# EAGLE design pcb (EAGLE 9.6.2)
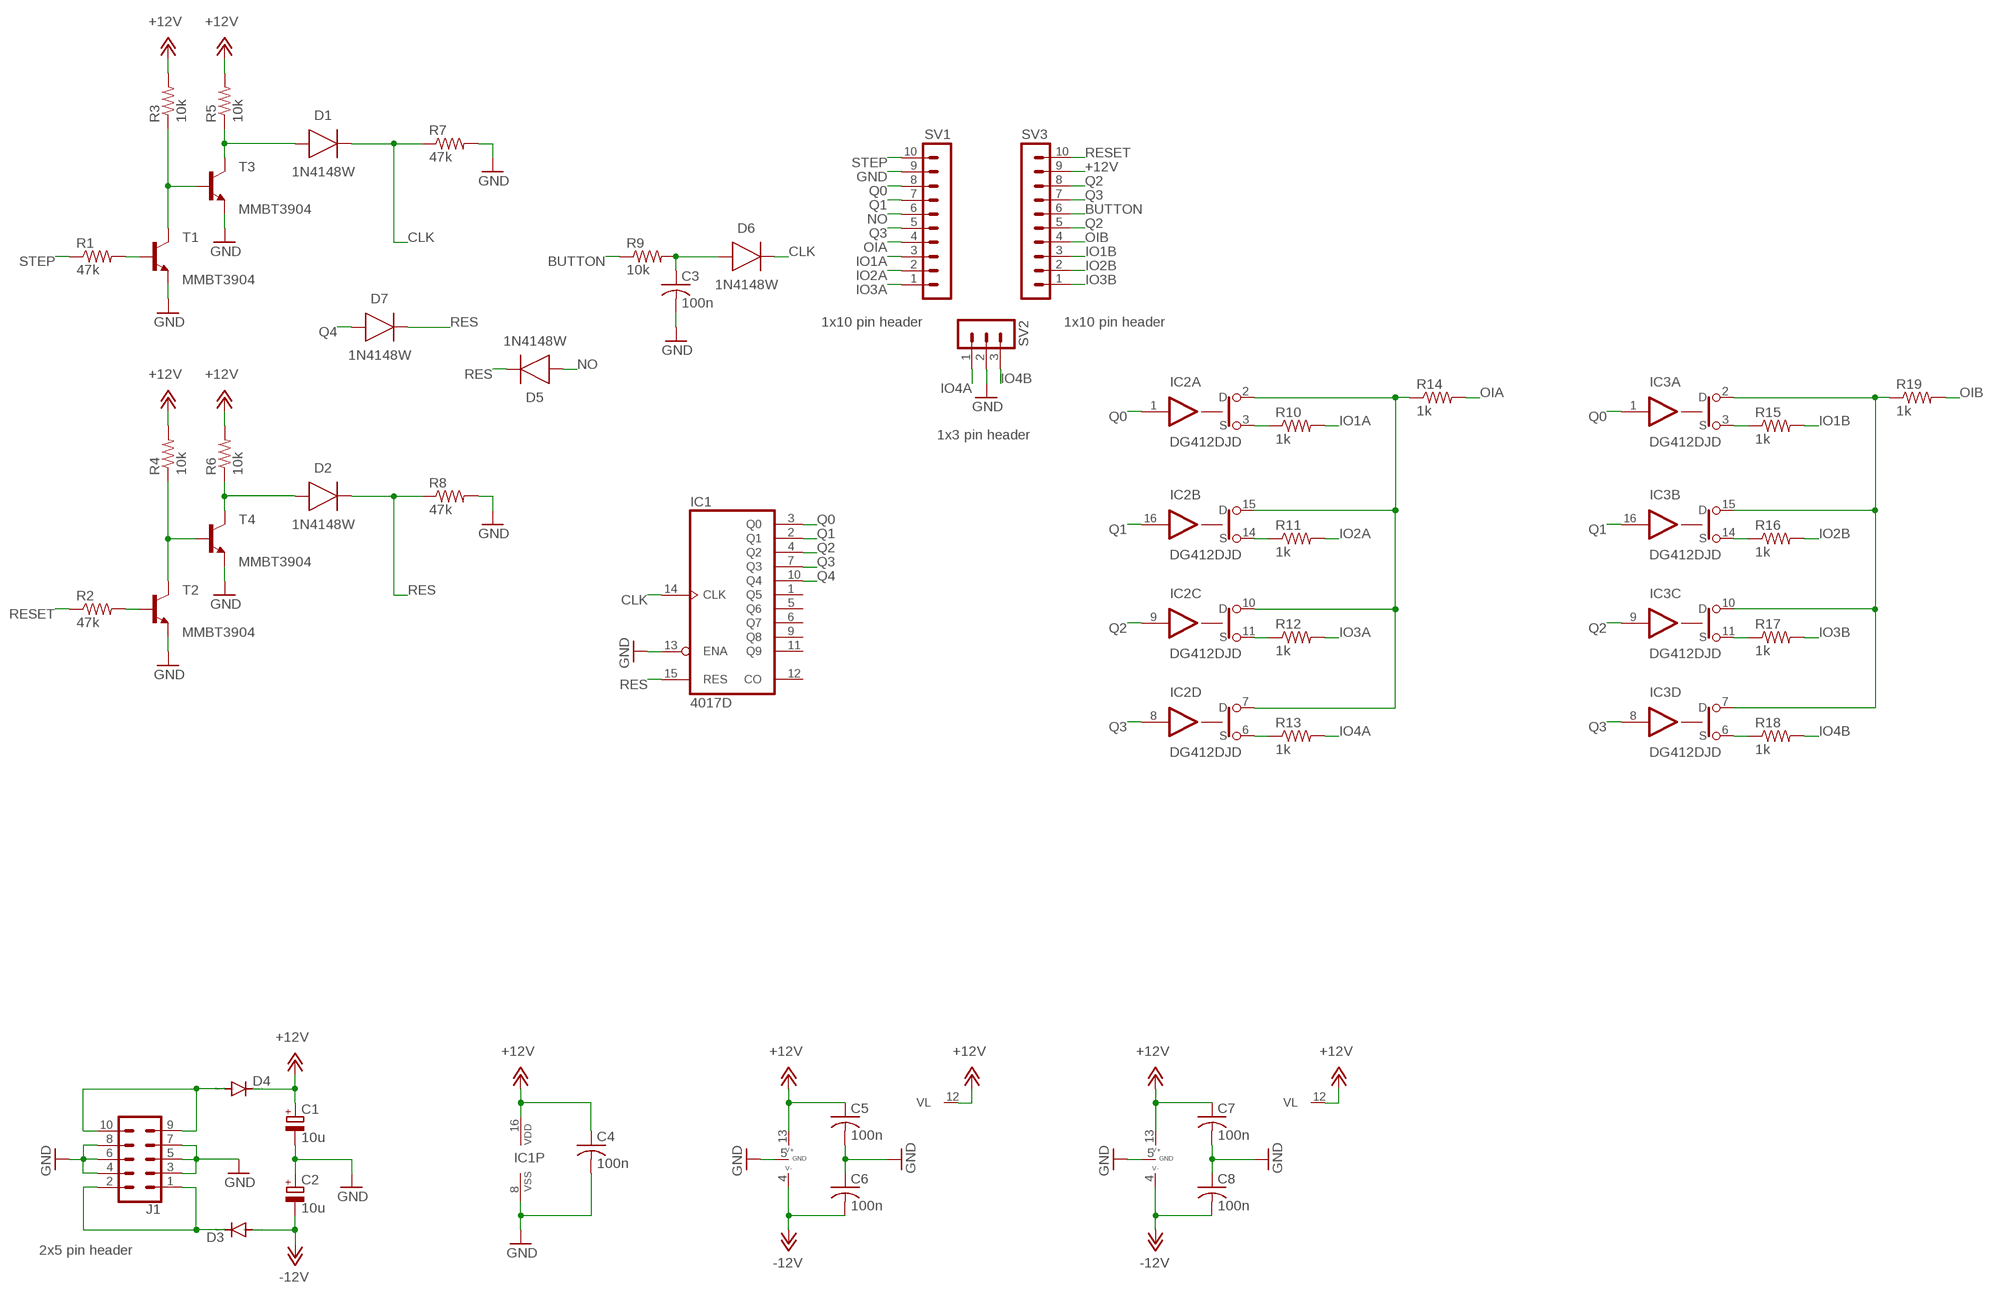
[diagram p0: schematic, sheet 1]

## Parts
C1  10u  CPOL-EU153CLV-0605  [153CLV-0605]
C2  10u  CPOL-EU153CLV-0605  [153CLV-0605]
C3  100n  C-USC0603  [C0603]
C4  100n  C-USC0603  [C0603]
C5  100n  C-USC0603  [C0603]
C6  100n  C-USC0603  [C0603]
C7  100n  C-USC0603  [C0603]
C8  100n  C-USC0603  [C0603]
D1  1N4148W  DIODE_1N4148W-7-F_SOD123G  [SOD3715X135]
D2  1N4148W  DIODE_1N4148W-7-F_SOD123G  [SOD3715X135]
D3  DIODE-SOD123  [SOD123]
D4  DIODE-SOD123  [SOD123]
D5  1N4148W  DIODE_1N4148W-7-F_SOD123G  [SOD3715X135]
D6  1N4148W  DIODE_1N4148W-7-F_SOD123G  [SOD3715X135]
D7  1N4148W  DIODE_1N4148W-7-F_SOD123G  [SOD3715X135]
IC1  4017D  [SO16]
IC2  DG412DJD  [SO16]
IC3  DG412DJD  [SO16]
J1  2x5 pin header  CONN_05X2SHD  [2X5-SHROUDED]
R1  47k  R-US_R0603  [R0603]
R2  47k  R-US_R0603  [R0603]
R3  10k  R-US_R0603  [R0603]
R4  10k  R-US_R0603  [R0603]
R5  10k  R-US_R0603  [R0603]
R6  10k  R-US_R0603  [R0603]
R7  47k  R-US_R0603  [R0603]
R8  47k  R-US_R0603  [R0603]
R9  10k  R-US_R0603  [R0603]
R10  1k  R-US_R0603  [R0603]
R11  1k  R-US_R0603  [R0603]
R12  1k  R-US_R0603  [R0603]
R13  1k  R-US_R0603  [R0603]
R14  1k  R-US_R0603  [R0603]
R15  1k  R-US_R0603  [R0603]
R16  1k  R-US_R0603  [R0603]
R17  1k  R-US_R0603  [R0603]
R18  1k  R-US_R0603  [R0603]
R19  1k  R-US_R0603  [R0603]
SV1  1x10 pin header  MA10-1  [MA10-1]
SV2  1x3 pin header  MA03-1  [MA03-1]
SV3  1x10 pin header  MA10-1  [MA10-1]
T1  MMBT3904  MMBT3904LT1-NPN-SOT23-BEC  [SOT23-BEC]
T2  MMBT3904  MMBT3904LT1-NPN-SOT23-BEC  [SOT23-BEC]
T3  MMBT3904  MMBT3904LT1-NPN-SOT23-BEC  [SOT23-BEC]
T4  MMBT3904  MMBT3904LT1-NPN-SOT23-BEC  [SOT23-BEC]

## Nets
+12V [SupplyLines]: C1.+ C4.1 C5.1 C7.1 D4.C IC1.16(VDD) IC2.12(VL:VL) IC2.13(P:V+) IC3.12(VL:VL) IC3.13(P:V+) R3.2 R4.2 R5.2 R6.2 SV3.9
-12V [SupplyLines]: C2.- C6.2 C8.2 D3.A IC2.4(P:V-) IC3.4(P:V-)
BUTTON: R9.1 SV3.6
CLK: D1.1(C) D6.1(C) IC1.14(CLK) R7.1
GND [SupplyLines]: C1.- C2.+ C3.2 C4.2 C5.2 C6.1 C7.2 C8.1 IC1.8(VSS) IC1.13(ENA) IC2.5(P:GND) IC3.5(P:GND) J1.3 J1.4 J1.5 J1.6 J1.7 J1.8 R7.2 R8.2 SV1.9 SV2.2 T1.E T2.E T3.E T4.E
IO1A: R10.2 SV1.3
IO1B: R15.2 SV3.3
IO2A: R11.2 SV1.2
IO2B: R16.2 SV3.2
IO3A: R12.2 SV1.1
IO3B: R17.2 SV3.1
IO4A: R13.2 SV2.1
IO4B: R18.2 SV2.3
N$1 [SupplyLines]: D4.A J1.9 J1.10
N$2 [SupplyLines]: D3.C J1.1 J1.2
N$3: IC2.2(A:D) IC2.7(D:D) IC2.10(C:D) IC2.15(B:D) R14.1
N$4: IC2.3(A:S) R10.1
N$5: IC3.2(A:D) IC3.7(D:D) IC3.10(C:D) IC3.15(B:D) R19.1
N$6: IC2.14(B:S) R11.1
N$7: IC2.11(C:S) R12.1
N$8: IC2.6(D:S) R13.1
N$9: IC3.3(A:S) R15.1
N$10: IC3.14(B:S) R16.1
N$11: IC3.11(C:S) R17.1
N$12: IC3.6(D:S) R18.1
N$13: C3.1 D6.2(A) R9.2
N$14: R1.2 T1.B
N$15: R3.1 T1.C T3.B
N$16: D1.2(A) R5.1 T3.C
N$19: R2.2 T2.B
N$20: R4.1 T2.C T4.B
N$21: D2.2(A) R6.1 T4.C
NO: D5.2(A) SV1.6
OIA: R14.2 SV1.4
OIB: R19.2 SV3.4
Q0: IC1.3(Q0) IC2.1(A:IN) IC3.1(A:IN) SV1.8
Q1: IC1.2(Q1) IC2.16(B:IN) IC3.16(B:IN) SV1.7
Q2: IC1.4(Q2) IC2.9(C:IN) IC3.9(C:IN) SV3.5 SV3.8
Q3: IC1.7(Q3) IC2.8(D:IN) IC3.8(D:IN) SV1.5 SV3.7
Q4: D7.2(A) IC1.10(Q4)
RES: D2.1(C) D5.1(C) D7.1(C) IC1.15(RES) R8.1
RESET: R2.1 SV3.10
STEP: R1.1 SV1.10
Unconnected: IC1.1(Q5) IC1.5(Q6) IC1.6(Q7) IC1.9(Q8) IC1.11(Q9) IC1.12(CO)

## Library data of the parts
C1 C2 = rcl:CPOL-EU: POLARIZED CAPACITOR, European symbol; SPICEPREFIX: C
C3-C8 = rcl:C-US: CAPACITOR, American symbol; SPICEPREFIX: C
D1 D2 D5-D7 = Diode:DIODE_: Diode Rectifier - Popular parts; CATEGORY: Diode; DESCRIPTION: DIODE GEN PURP 100V 300MA SOD123; MANUFACTURER: Diodes Incorporated; SUB-CATEGORY: Rectifier
D3 D4 = diode:DIODE-: DIODE
IC1 = 40xx:4017: COUNTER/DIVIDER
IC2 IC3 = linear:DG412DJ: CMOS SWITCH
J1 = SparkFun-Connectors:CONN_05X2: Multi connection point. Often used as Generic Header-pin footprint for 0.1 inch spaced/style header connections For AVR SPI programming port, see special device with nice symbol: "AVR_SPI_PROG_5x2.dev" You can populate with any combo of single row headers, but if you'd like an exact match, check these: 2x5 AVR ICSP Male Header <https://www.sparkfun.com/products/778> (PRT-00778) 2x5 Pin Shrouded Header <https://www.sparkfun.com/products/8506> (PRT-08506) On any of the 0.1 inch spaced packages, you can populate with these: Break Away Headers - Straight <https://www.sparkfun.com/products/116> (PRT-00116) Break Away Male Headers - Right Angle <https://www.sparkfun.com/products/553> (PRT-00553) Female Headers <https://www.sparkfun.com/products/115> (PRT-00115) Break Away Headers - Machine Pin <https://www.sparkfun.com/products/117> (PRT-00117) Break Away Female Headers - Swiss Machine Pin <https://www.sparkfun.com/products/743> (PRT-00743) Special note: the shrouded connector mates well with our 5x2 ribbon cables: 2x5 Pin IDC Ribbon Cable <https://www.sparkfun.com/products/8535> (PRT-08535); PROD_ID: CONN-08671; SF_ID: PRT-08506
R1-R19 = rcl:R-US_: RESISTOR, American symbol; SPICEPREFIX: R
SV1 SV3 = con-lstb:MA10-1: PIN HEADER; OC_FARNELL: unknown; OC_NEWARK: unknown
SV2 = con-lstb:MA03-1: PIN HEADER; OC_FARNELL: unknown; OC_NEWARK: unknown
T1-T4 = transistor:*-NPN-: NPN Transistror BF959 corrected 2008.03.06

## Net classes
0 default: width 0.254 mm, drill 0.203 mm, clearance 0.203 mm
1 SupplyLines: width 0.406 mm, drill 0.203 mm, clearance 0.203 mm

## Board
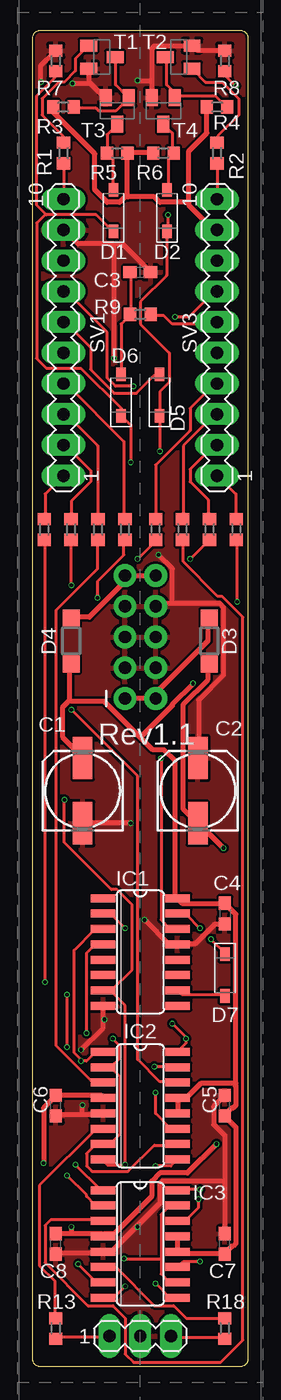
[diagram p1: board, top side]
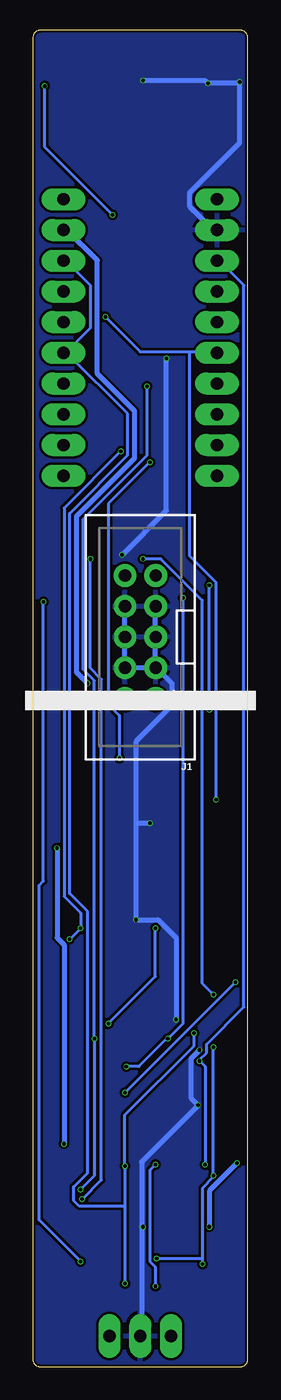
[diagram p2: board, bottom side, seen from below]

Size 17.78 x 110.49 mm. Coordinates in mm from the lower left corner, seen from the top.
Copper layers (1*16): Top 0.035mm / dielectric 1.6mm / Bottom 0.035mm
Design rules "jlcpcb-2layers *": minimum track width 5mil, minimum drill 0.3mm, track to track 5mil, track to pad 5mil, pad to pad 5mil, via to via 10mil, smd to smd 5mil, copper to edge 0.2mm, drill to drill 6mil, minimum pad ring 10mil, minimum via ring 3mil, stop-mask expansion 4mil, vias tented up to drill 0mil, thermal gap 10mil

### Footprints (pad centres in the part's own frame; a part is rotated, then mirrored left to right if it is on the bottom)
153CLV-0605 = smd 3.5 x 1.6: + 2.7,0; - -2.7,0
C0603 = smd 1.1 x 1: 1 -0.85,0; 2 0.85,0
SOD3715X135 = smd 1.127 x 0.784: 1 -1.722,0; 2 1.722,0
SOD123 = smd 1.4 x 1.4: A 1.9,0; C -1.9,0
SO16 = smd 0.66 x 2.032: 1 -4.445,-3.073; 2 -3.175,-3.073; 3 -1.905,-3.073; 4 -0.635,-3.073; 5 0.635,-3.073; 6 1.905,-3.073; 7 3.175,-3.073; 8 4.445,-3.073; 9 4.445,3.073; 10 3.175,3.073; 11 1.905,3.073; 12 0.635,3.073; 13 -0.635,3.073; 14 -1.905,3.073; 15 -3.175,3.073; 16 -4.445,3.073
2X5-SHROUDED = drill 1.016 pad 1.88: 1 -1.27,5.08; 2 1.27,5.08; 3 -1.27,2.54; 4 1.27,2.54; 5 -1.27,0; 6 1.27,0; 7 -1.27,-2.54; 8 1.27,-2.54; 9 -1.27,-5.08; 10 1.27,-5.08
R0603 = smd 1 x 1.1: 1 -0.85,0; 2 0.85,0
MA10-1 = drill 1.016 long: 1 -11.43,0; 2 -8.89,0; 3 -6.35,0; 4 -3.81,0; 5 -1.27,0; 6 1.27,0; 7 3.81,0; 8 6.35,0; 9 8.89,0; 10 11.43,0
MA03-1 = drill 1.016 long: 1 -2.54,0; 2 0,0; 3 2.54,0
SOT23-BEC = smd 1 x 1.4: B -0.95,-1.1; C 0,1.1; E 0.95,-1.1

### Placement (x,y rotation side)
C1  4.13,47.62 90 top
C2  13.65,47.62 90 top
C3  8.89,90.49 0 top
C4  15.88,37.46 270 top
C5  15.88,21.59 90 top
C6  1.9,21.59 90 top
C7  15.88,10.16 90 top
C8  1.9,10.16 90 top
D1  6.67,95.57 90 top
D2  11.11,95.57 90 top
D3  14.61,60.01 270 top
D4  3.18,60.01 90 top
D5  10.48,80.33 90 top
D6  7.3,80.33 90 top
D7  15.88,32.38 270 top
IC1  8.89,34.29 270 top
IC2  8.89,21.59 270 top
IC3  8.89,10.16 270 top
J1  8.89,60.33 180 bottom
R1  2.54,100.33 90 top
R2  15.24,100.33 90 top
R3  2.54,104.14 180 top
R4  15.24,104.14 180 top
R5  6.99,100.33 0 top
R6  10.79,100.33 180 top
R7  1.9,107.95 90 top
R8  15.88,107.95 90 top
R9  8.89,87 180 top
R10  5.4,69.22 90 top
R11  3.18,69.22 90 top
R12  0.95,69.22 90 top
R13  1.9,3.17 270 top
R14  7.62,69.22 90 top
R15  12.38,69.22 90 top
R16  14.61,69.22 90 top
R17  16.83,69.22 90 top
R18  15.88,3.17 270 top
R19  10.16,69.22 90 top
SV1  2.54,85.09 90 top
SV2  8.89,2.54 0 top
SV3  15.24,85.09 90 top
T1  5.71,108.27 270 top
T2  12.07,108.27 90 top
T3  6.99,103.82 180 top
T4  10.79,103.82 180 top
U$1  [EURO_PCB_4HP]  -1.27,-8.89 0 top  (outside the outline)

### Tracks (layer width: path | path; a pad name or v marks a point on that pad's centre or on a via)
+12V  (via drill 0.3)
  Top 0.406: R6.2 9.93,100.38 7.87,100.38 R5.2 7.76,100.15 7.76,96.84 | 7.76,96.84 7.19,96.27 6.16,96.27 5.13,97.3 5.13,100.27 1.7,103.69 1.7,104.04 R3.2 | 12.9,96.27 12.9,96.04 14.96,93.98 SV3.9 | 12.9,96.27 12.9,100.5 14.39,101.98 14.39,104.04 R4.2 | 12.9,96.27 10.5,96.27 10.05,96.72 7.87,96.72 7.76,96.84 | 3.07,55.12 3.07,58.09 D4.C | 3.07,55.12 2.5,54.55 2.5,52.03 4.1,50.43 C1.+ | IC3.13 11.99,10.77 11.99,9.63 IC3.12 11.99,9.51 12.1,9.4 15.88,9.4 C7.1 15.99,9.51 16.45,9.97 16.56,9.97 16.79,10.2 16.79,19.8 15.99,20.6 C5.1 15.88,20.83 16.45,21.4 16.56,21.4 16.79,21.63 16.79,23.23 16.68,23.34 | 16.68,23.34 16.56,23.46 13.93,23.46 12.79,22.31 11.99,22.31 IC2.13 11.99,22.09 11.99,21.06 IC2.12 | 16.68,23.34 16.79,23.46 16.79,37.4 15.99,38.2 C4.1 12.33,38.32 11.99,38.66 IC1.16 11.76,38.77 11.76,50.09 10.85,51 9.93,51 8.9,52.03 | 8.9,52.03 5.93,55 3.19,55 3.07,55.12 | v13.25,56.49 11.53,54.77 11.53,54.66 8.9,52.03
  Bottom 0.406: SV3.9 14.96,93.98 12.45,91.47 12.45,82.09 9.36,79.01 9.36,75.12 14.16,70.32 14.16,57.4 v13.25,56.49
-12V  (via drill 0.3)
  Top 0.406: 3.19,11 5.7,11 5.82,10.88 IC3.4 5.93,11 6.73,11 9.82,14.08 9.82,15.34 10.5,16.03 12.79,16.03 v15.19,18.43 | 3.19,11 1.93,11 C8.2 | IC2.4 5.82,22.31 5.7,22.43 1.93,22.43 C6.2 1.82,22.31 0.9,21.4 v0.9,16.83 | v3.19,11.57 3.19,11 | D3.A 14.5,58.09 14.5,56.83 12.45,54.77 12.45,46.09 13.59,44.95 C2.- 13.82,44.83 v15.76,42.89
  Bottom 0.406: v3.19,11.57 3.19,14.54 v0.9,16.83 | v15.19,18.43 15.19,34.89 15.76,35.46 v15.76,42.89
BUTTON
  Top 0.254: R9.1 9.82,86.89 10.85,86.89 11.53,86.21 15.07,86.21 15.19,86.32 SV3.6
CLK  (via drill 0.3)
  Top 0.254: 1.07,95.29 1.13,95.24 5.24,95.24 6.62,93.87 D1.1 | 1.07,95.29 0.33,96.04 0.33,105.07 1.82,106.55 1.82,107.01 R7.1 | 1.07,95.29 0.33,94.55 0.33,83.35 1.13,82.55 3.99,82.55 7.3,79.23 D6.1 7.42,78.55 8.1,77.86 v8.1,74.78 | v10.62,50.32 10.62,36.94 11.3,36.26 11.88,36.26 IC1.14
  Bottom 0.254: v10.62,50.32 10.62,53.86 11.53,54.77 11.53,71.35 v8.1,74.78
GND  (via drill 0.3)
  Top 0.406: C8.1 1.93,9.4 5.7,9.4 IC3.5 5.93,9.63 6.62,9.63 8.62,11.63 | 15.88,15.34 15.88,19.11 14.96,20.03 14.96,21.51 15.88,22.43 C5.2 | 15.88,15.34 C7.2 | 8.62,11.63 10.5,13.51 10.5,15.11 10.73,15.34 15.88,15.34 | 4.1,20.83 5.7,20.83 IC2.5 | 4.1,20.83 1.93,20.83 C6.1 | 5.82,28.71 5.82,28.03 v3.99,26.2 | 5.82,28.71 IC1.8 | 4.1,20.83 v4.1,21.63 | v8.67,11.57 8.62,11.63 | R8.2 15.88,108.84 13.59,108.84 13.25,109.18 T2.E 13.02,109.18 10.05,109.18 9.82,108.95 9.82,106.32 | 9.82,106.32 9.82,104.95 T4.E | 4.67,106.21 4.67,107.24 T1.E | 4.67,106.21 5.93,104.95 T3.E | SV1.9 2.62,93.98 3.76,92.84 6.67,92.84 | v0.67,106.21 0.67,107.58 1.82,108.72 R7.2 | v3.3,106.1 4.56,106.1 4.67,106.21 | v8.67,106.32 9.82,106.32 | 11.53,63.12 10.39,63.12 10.16,62.89 J1.8 | 11.53,63.12 15.42,63.12 15.76,62.78 15.76,57.17 13.7,55.12 13.7,50.43 C2.+ | C4.2 15.07,36.6 13.47,35 11.99,35 IC1.13 11.76,34.89 11.3,34.89 v9.25,36.94 | v8.1,44.95 4.22,44.95 C1.- | v10.39,67.12 11.53,65.98 11.53,63.12 | v5.93,28.71 5.82,28.71 | 6.67,92.84 7.39,92.84 C3.2 | 6.67,92.84 6.73,92.77 v6.73,83.35
  Bottom 0.406: v3.99,26.2 4.67,25.51 4.67,22.2 v4.1,21.63 8.79,16.94 8.79,11.57 | 8.79,11.57 8.79,2.54 SV2.2 | v8.67,11.57 8.79,11.57 | SV1.9 2.85,93.98 4.79,95.92 4.79,97.07 0.67,101.18 v0.67,106.21 0.79,106.1 v3.3,106.1 3.53,106.32 v8.67,106.32 | 9.25,44.95 9.25,51.69 6.27,54.66 6.27,56.49 7.53,57.75 J1.3 | 9.25,44.95 v9.25,36.94 7.42,36.94 5.93,35.46 v5.93,28.71 | 9.25,44.95 v8.1,44.95 | J1.3 7.64,57.97 7.64,60.26 J1.5 7.64,60.49 7.64,62.78 J1.7 | J1.3 7.76,57.75 10.16,57.75 J1.4 J1.6 J1.8 | v6.73,83.35 6.73,70.78 v10.39,67.12
  pour Bottom: 0,110.49 17.78,110.49 17.78,0 0,0
  pour Top: 0,110.49 17.78,110.49 17.78,0 0,0
IO1A
  Top 0.254: R10.2 5.36,70.09 5.36,76.15 2.85,78.66 2.62,78.66 SV1.3
IO1B
  Top 0.254: R15.2 12.45,70.09 12.45,76.15 14.96,78.66 15.19,78.66 SV3.3
IO2A
  Top 0.254: R11.2 3.19,70.09 3.19,71.58 4.79,73.18 4.79,74.09 2.62,76.26 SV1.2
IO2B
  Top 0.254: R16.2 14.5,70.09 14.5,71.69 13.02,73.18 13.02,74.21 14.96,76.15 15.19,76.15 SV3.2
IO3A
  Top 0.254: R12.2 1.02,70.09 1.02,72.15 2.5,73.64 SV1.1
IO3B
  Top 0.254: R17.2 16.79,70.09 16.79,72.15 15.3,73.64 SV3.1
IO4A
  Top 0.254: R13.2 1.93,2.43 6.16,2.43 6.27,2.54 SV2.1
IO4B
  Top 0.254: R18.2 15.88,2.43 11.65,2.43 11.53,2.54 SV2.3
N$1
  Top 0.406: D4.A 3.19,61.98 4.67,61.98 7.53,64.83 7.53,65.41 J1.9 J1.10
N$2
  Top 0.406: D3.C 14.5,61.86 14.5,60.03 10.16,55.69 J1.2 10.05,55.23 7.64,55.23 J1.1
N$3  (via drill 0.3)
  Top 0.254: v5.36,63.58 5.36,64.95 7.53,67.12 7.53,68.26 R14.1 | v6.62,27.12 7.19,26.54 7.19,25.51 6.5,24.83 5.82,24.83 IC2.2 6.5,24.71 7.19,24.03 7.19,19.23 6.39,18.43 5.82,18.43 IC2.7 5.7,18.43 5.24,18.43 4.45,17.63 4.45,16.6 4.9,16.14 7.87,16.14 10.05,18.31 11.88,18.31 IC2.10 | v10.05,24.83 11.88,24.83 IC2.15
  Bottom 0.254: v5.36,63.58 5.36,28.37 v6.62,27.12 6.73,27.12 9.02,24.83 v10.05,24.83
N$4
  Top 0.254: R10.1 5.36,68.26 5.36,65.98 1.93,62.55 1.93,26.54 4.9,23.57 5.82,23.57 IC2.3
N$5  (via drill 0.3)
  Top 0.254: 10.62,8.94 10.62,12.6 11.3,13.28 11.88,13.28 IC3.15 | 10.62,8.94 10.62,7.68 11.3,7 11.88,7 IC3.10 | v8.67,66.78 10.16,68.26 R19.1 | v2.85,26.43 v2.85,30.77 | v2.85,15.8 4.45,14.2 4.45,14.08 5.13,13.4 5.82,13.4 IC3.2 | v3.76,8.48 5.24,7 IC3.7 | v7.53,8.94 10.62,8.94
  Bottom 0.254: v8.67,66.78 7.19,66.78 3.76,63.35 3.76,31.69 v2.85,30.77 | v2.85,26.43 v2.85,15.8 2.85,15.68 3.76,14.77 3.76,8.94 | 3.76,8.94 v3.76,8.48 | 3.76,8.94 v7.53,8.94
N$6  (via drill 0.3)
  Top 0.254: v3.19,64.61 3.19,68.26 R11.1 | v3.19,54.32 8.67,48.83 8.67,25.4 10.5,23.57 11.88,23.57 IC2.14
  Bottom 0.254: v3.19,54.32 v3.19,64.61
N$7  (via drill 0.3)
  Top 0.254: v1.02,31.8 1.02,68.26 R12.1 | v10.16,22.66 10.16,20.94 11.42,19.68 IC2.11
  Bottom 0.254: v10.16,22.66 v1.02,31.8
N$8
  Top 0.254: IC2.6 5.24,19.68 0.56,15 0.56,8.37 1.82,7.11 1.82,4.03 R13.1
N$9
  Top 0.254: R15.1 12.45,68.26 12.45,66.55 15.3,63.69 15.65,63.69 17.36,61.98 17.36,2.2 15.53,0.37 8.33,0.37 7.64,1.05 7.64,4.03 6.62,5.05 4.56,5.05 1.02,8.6 1.02,11.68 1.47,12.14 5.82,12.14 IC3.3
N$10  (via drill 0.3)
  Top 0.254: v13.02,66.78 14.5,68.26 R16.1 | v13.7,13.86 13.7,13.17 12.68,12.14 11.99,12.14 IC3.14
  Bottom 0.254: v13.02,66.78 13.02,57.75 12.1,56.83 12.1,15.46 v13.7,13.86
N$11  (via drill 0.3)
  Top 0.254: v16.9,63.23 16.9,68.26 R17.1 | v13.82,8.71 12.45,8.71 11.99,8.25 IC3.11
  Bottom 0.254: v16.9,63.23 16.9,40.14 17.25,39.8 17.25,12.14 v13.82,8.71
N$12
  Top 0.254: IC3.6 6.85,8.25 10.05,5.05 11.65,5.05 12.68,4.03 R18.1
N$13
  Top 0.254: C3.1 8.1,90.44 8.1,87.01 R9.2 7.99,86.89 7.3,86.21 D6.2
N$14
  Top 0.254: R1.2 2.5,101.18 2.5,101.75 0.79,103.47 0.79,104.84 2.16,106.21 2.62,106.21 3.53,107.12 3.53,108.15 4.56,109.18 T1.B
N$15
  Top 0.254: R3.1 3.42,104.04 5.24,104.04 5.47,103.81 6.85,103.81 7.87,104.84 T3.B 7.87,104.95 6.85,105.98 6.85,108.27 T1.C
N$16
  Top 0.254: T3.C 6.96,102.67 6.16,101.87 6.16,100.38 R5.1 6.16,100.27 6.62,99.81 6.62,97.3 D1.2
N$19
  Top 0.254: R2.2 15.3,101.18 15.3,101.75 17.02,103.47 17.02,104.84 15.65,106.21 14.28,106.21 13.25,107.24 T2.B
N$20
  Top 0.254: R4.1 15.99,104.15 15.07,105.07 11.88,105.07 11.76,104.95 T4.B 11.88,105.18 11.07,105.98 11.07,108.27 T2.C
N$21
  Top 0.254: T4.C 10.85,102.67 11.53,101.98 11.53,100.38 R6.1 11.53,100.27 11.19,99.92 11.19,97.3 D2.2
NO
  Top 0.254: D5.2 10.39,81.98 10.05,81.98 8.56,80.49 6.73,80.49 4.79,82.44 4.79,84.26 2.62,86.44 SV1.6
OIA
  Top 0.254: R14.2 7.53,70.09 7.53,76.49 2.85,81.18 2.62,81.18 SV1.4
OIB
  Top 0.254: R19.2 10.16,74.55 13.02,77.41 13.02,79.23 14.96,81.18 15.19,81.18 SV3.4
Q0  (via drill 0.3)
  Top 0.254: v3.53,16.71 5.59,14.66 5.82,14.66 IC3.1 | IC2.1 5.82,25.97 5.13,25.97 4.45,25.29 v3.99,25.29 3.99,25.4 3.42,25.97 3.42,34.43 5.13,36.14 5.82,36.14 IC1.3
  Bottom 0.254: v3.53,16.71 3.53,24.83 v3.99,25.29 3.99,25.4 3.42,25.97 3.42,26.66 0.33,29.74 0.33,89.41 2.27,91.35 2.5,91.35 SV1.8
Q1  (via drill 0.3)
  Top 0.254: v13.82,14.66 11.99,14.66 IC3.16 | IC2.16 11.99,26.09 12.68,26.77 v12.68,27.12 12.68,27.23 v11.53,28.37 | v7.64,36.26 6.5,37.4 5.82,37.4 IC1.2 | v8.33,81.06 6.85,81.06 6.16,81.75 6.16,85.52 2.85,88.84 2.62,88.84 SV1.7
  Bottom 0.254: v13.82,14.66 12.68,15.8 v12.68,27.12 12.68,56.72 13.59,57.63 13.59,70.09 8.33,75.35 v8.33,81.06 | v7.64,36.26 7.64,32.26 v11.53,28.37
Q2  (via drill 0.3)
  Top 0.254: v10.16,6.88 11.3,5.74 11.88,5.74 IC3.9 | v10.16,16.6 11.42,16.6 IC2.9 | v4.45,27.57 4.45,34.2 5.13,34.89 5.82,34.89 IC1.4
  Bottom 0.254: SV3.8 15.19,91.35 14.96,91.35 13.02,89.41 13.02,85.86 14.96,83.92 15.19,83.92 SV3.5 14.96,83.81 9.93,78.78 9.93,75.35 14.73,70.55 14.73,39.12 13.25,37.63 13.25,16.03 14.39,14.88 14.39,13.74 13.93,13.28 10.16,13.28 | 10.16,13.28 v10.16,16.6 10.16,20.83 4.45,26.54 v4.45,27.57 | 10.16,13.28 v10.16,6.88
Q3  (via drill 0.3)
  Top 0.254: v11.76,86.78 12.9,86.78 14.96,88.84 15.19,88.84 SV3.7 | v7.64,6.65 6.73,5.74 5.82,5.74 IC3.8 | IC2.8 5.82,17.06 6.16,16.71 v7.64,16.71 7.64,29.86 6.39,31.12 IC1.7 6.5,31.12 8.22,32.83 8.22,38.2 6.96,39.46 6.5,39.46 2.62,43.34 v2.62,46.89
  Bottom 0.254: 4.79,83.92 8.9,83.92 v11.76,86.78 | 4.79,83.92 2.62,83.92 SV1.5 | v7.64,6.65 7.64,8.25 8.1,8.71 8.1,16.26 v7.64,16.71 | 4.79,83.92 4.79,67 2.62,64.83 v2.62,46.89
Q4
  Top 0.254: D7.2 15.88,30.77 12.33,30.77 11.99,31.12 IC1.10
RES  (via drill 0.3)
  Top 0.254: v14.73,35.34 15.88,34.2 D7.1 | v13.82,36.26 12.68,37.4 11.99,37.4 IC1.15 | R8.1 15.88,106.78 v16.79,105.87 | v11.19,95.24 11.19,93.87 D2.1 11.07,93.75 11.07,90.21 8.9,88.04 8.9,86.21 11.3,83.81 11.3,81.41 10.5,80.61 10.5,78.66 D5.1 10.5,78.55 v10.5,75.69
  Bottom 0.254: v14.73,35.34 v13.82,36.26 13.82,37.52 15.19,38.89 15.19,71.01 v10.5,75.69 | v16.79,105.87 16.79,100.84 v11.19,95.24
RESET
  Top 0.254: R2.1 15.3,99.47 15.3,96.61 SV3.10
STEP
  Top 0.254: R1.1 2.62,99.47 2.62,96.61 SV1.10

### Text on the board
tNames: Rev1.1